# Altium schematic sheet gate.SchDoc
size A4; SheetNumber: 4; SheetTotal: 5
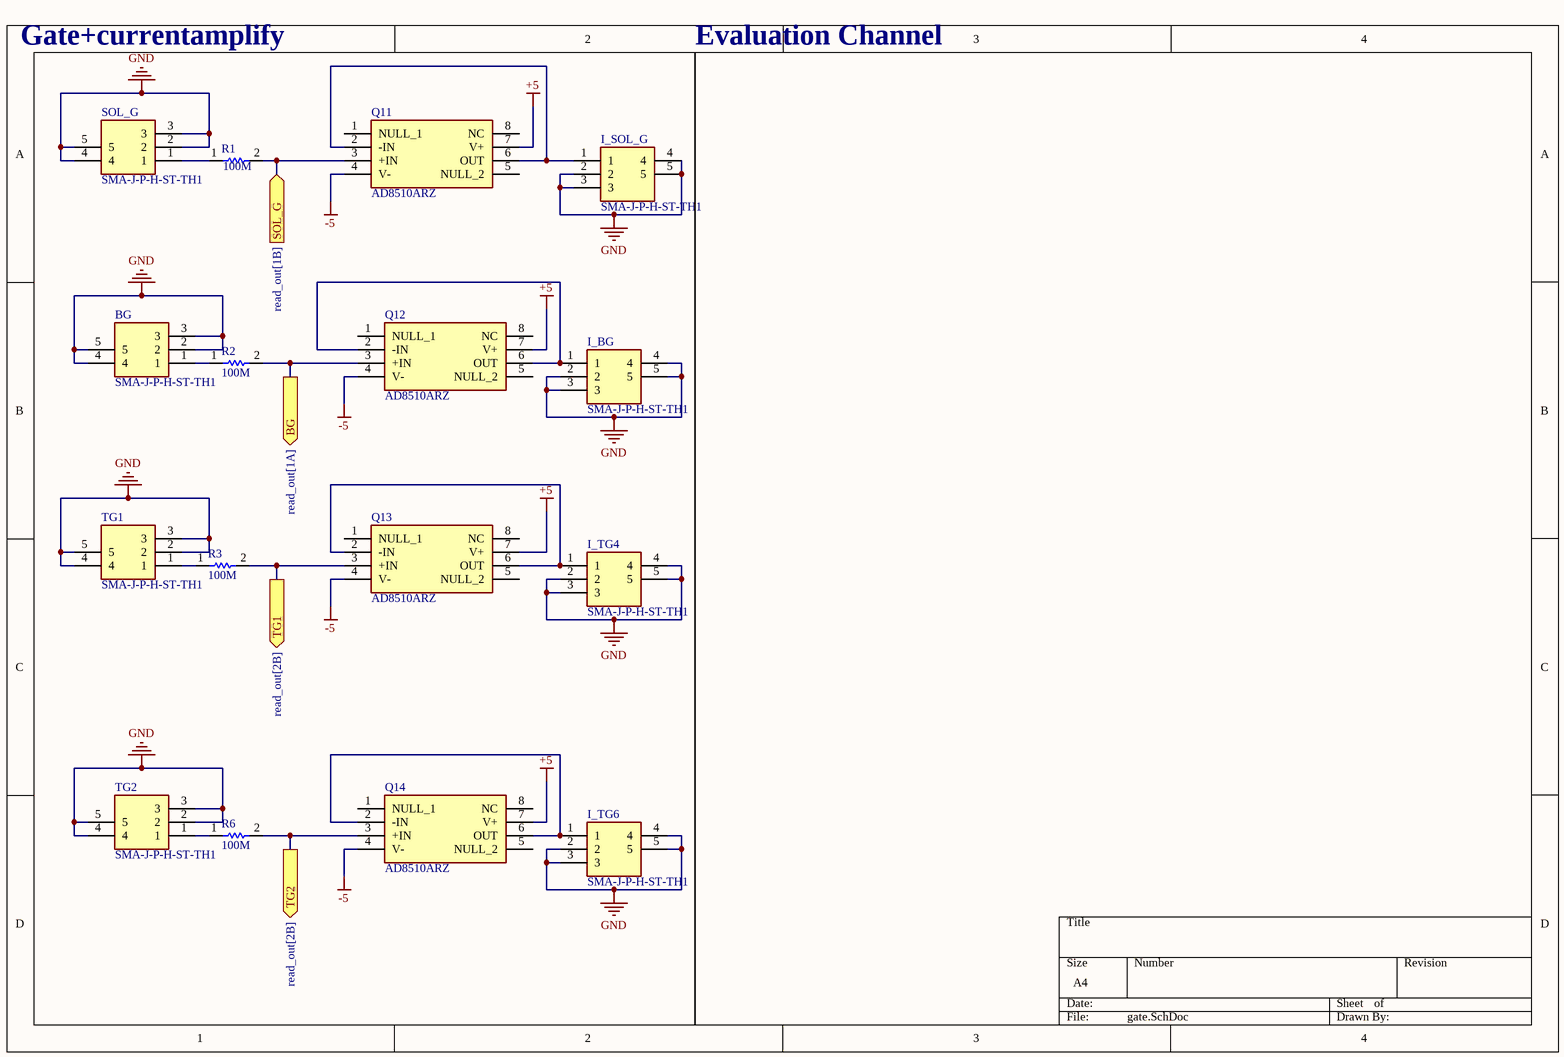
[diagram p0: gate.SchDoc]

## Parts
BG  SMA-J-P-H-ST-TH1  [SMAJPHSTTH1]
I_BG  SMA-J-P-H-ST-TH1  [SMAJPHSTTH1]
I_SOL_G  SMA-J-P-H-ST-TH1  [SMAJPHSTTH1]
I_TG4  SMA-J-P-H-ST-TH1  [SMAJPHSTTH1]
I_TG6  SMA-J-P-H-ST-TH1  [SMAJPHSTTH1]
Q11  AD8510ARZ  [AD8510ARZ]
Q12  AD8510ARZ  [AD8510ARZ]
Q13  AD8510ARZ  [AD8510ARZ]
Q14  AD8510ARZ  [AD8510ARZ]
R1  100M  [CR0805-FX-1543ELF]
R2  100M  [CR0805-FX-1543ELF]
R3  100M  [CR0805-FX-1543ELF]
R6  100M  [CR0805-FX-1543ELF]
SOL_G  SMA-J-P-H-ST-TH1  [SMAJPHSTTH1]
TG1  SMA-J-P-H-ST-TH1  [SMAJPHSTTH1]
TG2  SMA-J-P-H-ST-TH1  [SMAJPHSTTH1]

## Ports
BG (out, see read_out[1A]), SOL_G (in, see read_out[1B]), TG1 (out, see read_out[2B]), TG2 (out, see read_out[2B])

## Nets
+5: Q11.7(V+) Q12.7(V+) Q13.7(V+) Q14.7(V+)
-5: Q11.4(V-) Q12.4(V-) Q13.4(V-) Q14.4(V-)
GND: BG.2 BG.3 BG.4 BG.5 I_BG.2 I_BG.3 I_BG.4 I_BG.5 I_SOL_G.2 I_SOL_G.3 I_SOL_G.4 I_SOL_G.5 I_TG4.2 I_TG4.3 I_TG4.4 I_TG4.5 I_TG6.2 I_TG6.3 I_TG6.4 I_TG6.5 SOL_G.2 SOL_G.3 SOL_G.4 SOL_G.5 TG1.2 TG1.3 TG1.4 TG1.5 TG2.2 TG2.3 TG2.4 TG2.5
BG: Q12.3(+IN) R2.2 ; port BG
SOL_G: Q11.3(+IN) R1.2 ; port SOL_G
TG1: Q13.3(+IN) R3.2 ; port TG1
TG2: Q14.3(+IN) R6.2 ; port TG2
NetBG_1: BG.1 R2.1
NetI_BG_1: I_BG.1 Q12.2(-IN) Q12.6(OUT)
NetI_SOL_G_1: I_SOL_G.1 Q11.2(-IN) Q11.6(OUT)
NetI_TG4_1: I_TG4.1 Q13.2(-IN) Q13.6(OUT)
NetI_TG6_1: I_TG6.1 Q14.2(-IN) Q14.6(OUT)
NetR1_1: R1.1 SOL_G.1
NetR3_1: R3.1 TG1.1
NetR6_1: R6.1 TG2.1

Not connected (* = marked no-connect by the designer): Q11 1(NULL_1) 5(NULL_2) 8(NC); Q12 1(NULL_1) 5(NULL_2) 8(NC); Q13 1(NULL_1) 5(NULL_2) 8(NC); Q14 1(NULL_1) 5(NULL_2) 8(NC)

## Notes on the sheet
- Gate+currentamplify
- Evaluation Channel

## Library data of the parts
BG I_BG I_SOL_G I_TG4 I_TG6 SOL_G TG1 TG2 = SMA-J-P-H-ST-TH1: SAMTEC - SMA-J-P-H-ST-TH1 - RF COAXIAL, SMA JACK, 50 OHM, PCB; Geometry.Height: 9.55mm; Mouser Part Number: 200-SMAJPHSTTH1; Mouser Price/Stock: https://www.mouser.co.uk/ProductDetail/Samtec/SMA-J-P-H-ST-TH1?qs=bkXRl3BLxbHdaAB2Qwy6zw%3D%3D; Manufacturer_Name: SAMTEC; Manufacturer_Part_Number: SMA-J-P-H-ST-TH1; Datasheet Link: http://suddendocs.samtec.com/prints/sma-j-p-x-st-th1-mkt.pdf
R1-R3 R6 = resistor